# EAGLE design TCS3103 (EAGLE 6.4)
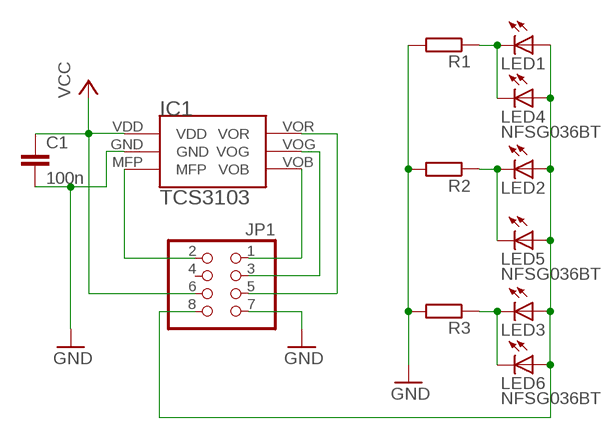
[diagram p0: schematic, sheet 1]

## Parts
C1  100n  C-EUC0805  [C0805]
IC1  TCS3103  [TCS3103]
JP1  PINHD-2X4  [2X04]
LED1  LED3MM  [LED3MM]
LED2  LED3MM  [LED3MM]
LED3  LED3MM  [LED3MM]
LED4  NFSG036BT  [NFSG036BT]
LED5  NFSG036BT  [NFSG036BT]
LED6  NFSG036BT  [NFSG036BT]
R1  R-EU_M0805  [M0805]
R2  R-EU_M0805  [M0805]
R3  R-EU_M0805  [M0805]

## Nets
GND: C1.2 IC1.GND JP1.7 R1.2 R2.2 R3.2
N$1: IC1.VOB JP1.1
N$2: IC1.VOG JP1.3
N$3: IC1.VOR JP1.5
N$4: IC1.MFP JP1.2
N$5: LED1.K(C) LED4.C R1.1
N$6: JP1.8 LED1.A LED2.A LED3.A LED4.A LED5.A LED6.A
N$7: LED3.K(C) LED6.C R3.1
N$8: LED2.K(C) LED5.C R2.1
VCC: C1.1 IC1.VDD JP1.6
Unconnected: JP1.4

## Library data of the parts
C1 = rcl:C-EU: CAPACITOR, European symbol
IC1 = BEEP:TCS3103
JP1 = pinhead:PINHD-2X4: PIN HEADER
LED1-LED3 = led:LED: LED OSRAM: - CHIPLED LG R971, LG N971, LY N971, LG Q971, LY Q971, LO R971, LY R971 LH N974, LH R974 LS Q976, LO Q976, LY Q976 LO Q996 - Hyper CHIPLED LW Q18S LB Q993, LB Q99A, LB R99A - SideLED LS A670, LO A670, LY A670, LG A670, LP A670 LB A673, LV A673, LT A673, LW A673 LH A674 LY A675 LS A676, LA A676, LO A676, LY A676, LW A676 LS A679, LY A679, LG A679 - Hyper Micro SIDELED® LS Y876, LA Y876, LO Y876, LY Y876 LT Y87S - SmartLED LW L88C, LW L88S LB L89C, LB L89S, LG L890 LS L89K, LO L89K, LY L89K LS L896, LA L896, LO L896, LY L896 - TOPLED LS T670, LO T670, LY T670, LG T670, LP T670 LSG T670, LSP T670, LSY T670, LOP T670, LYG T670 LG T671, LOG T671, LSG T671 LB T673, LV T673, LT T673, LW T673 LH T674 LS T676, LA T676, LO T676, LY T676, LB T676, LH T676, LSB T676, LW T676 LB T67C, LV T67C, LT T67C, LS T67K, LO T67K, LY T67K, LW E67C LS E67B, LA E67B, LO E67B, LY E67B, LB E67C, LV E67C, LT E67C LW T67C LS T679, LY T679, LG T679 LS T770, LO T770, LY T770, LG T770, LP T770 LB T773, LV T773, LT T773, LW T773 LH T774 LS E675, LA E675, LY E675, LS T675 LS T776, LA T776, LO T776, LY T776, LB T776 LHGB T686 LT T68C, LB T68C - Hyper Mini TOPLED® LB M676 - Mini TOPLED Santana® LG M470 LS M47K, LO M47K, LY M47K Source: http://www.osram.convergy.de LUXEON: - LUMILED® LXK2-PW12-R00, LXK2-PW12-S00, LXK2-PW14-U00, LXK2-PW14-V00 LXK2-PM12-R00, LXK2-PM12-S00, LXK2-PM14-U00 LXK2-PE12-Q00, LXK2-PE12-R00, LXK2-PE12-S00, LXK2-PE14-T00, LXK2-PE14-U00 LXK2-PB12-K00, LXK2-PB12-L00, LXK2-PB12-M00, LXK2-PB14-N00, LXK2-PB14-P00, LXK2-PB14-Q00 LXK2-PR12-L00, LXK2-PR12-M00, LXK2-PR14-Q00, LXK2-PR14-R00 LXK2-PD12-Q00, LXK2-PD12-R00, LXK2-PD12-S00 LXK2-PH12-R00, LXK2-PH12-S00 LXK2-PL12-P00, LXK2-PL12-Q00, LXK2-PL12-R00 Source: www.luxeon.com KINGBRIGHT: KA-3528ASYC Source: www.kingbright.com
LED4-LED6 = led:NFSG036BT: CHIP TYPE GREEN LED NFSx036xT Source: NICHIA CORPORATION .. NFSG036BT-E.pdf
R1-R3 = rcl:R-EU_: RESISTOR, European symbol

## Board
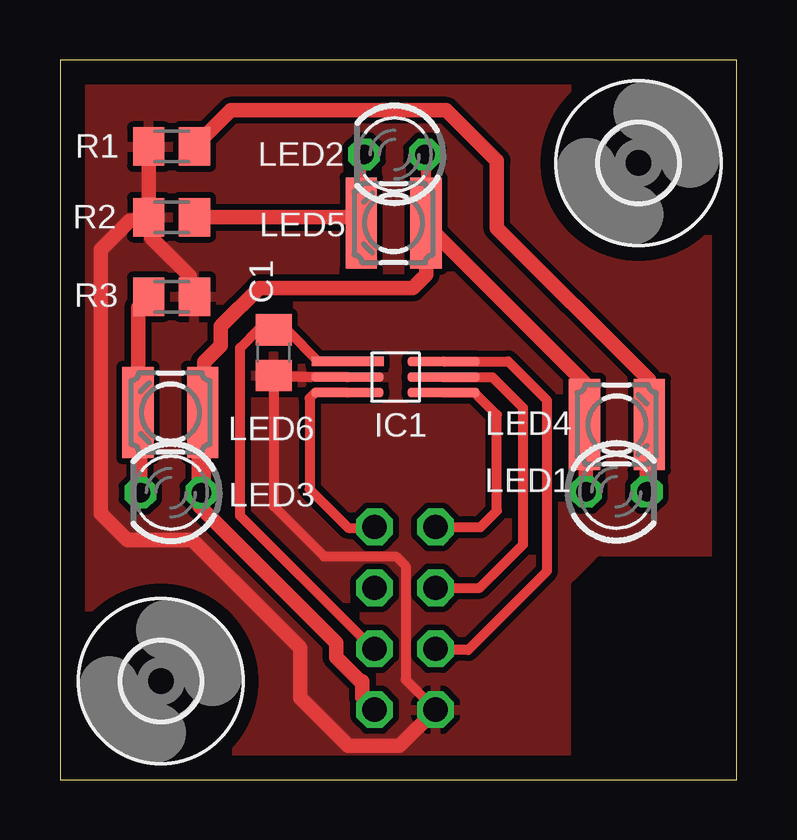
[diagram p1: board, top side]
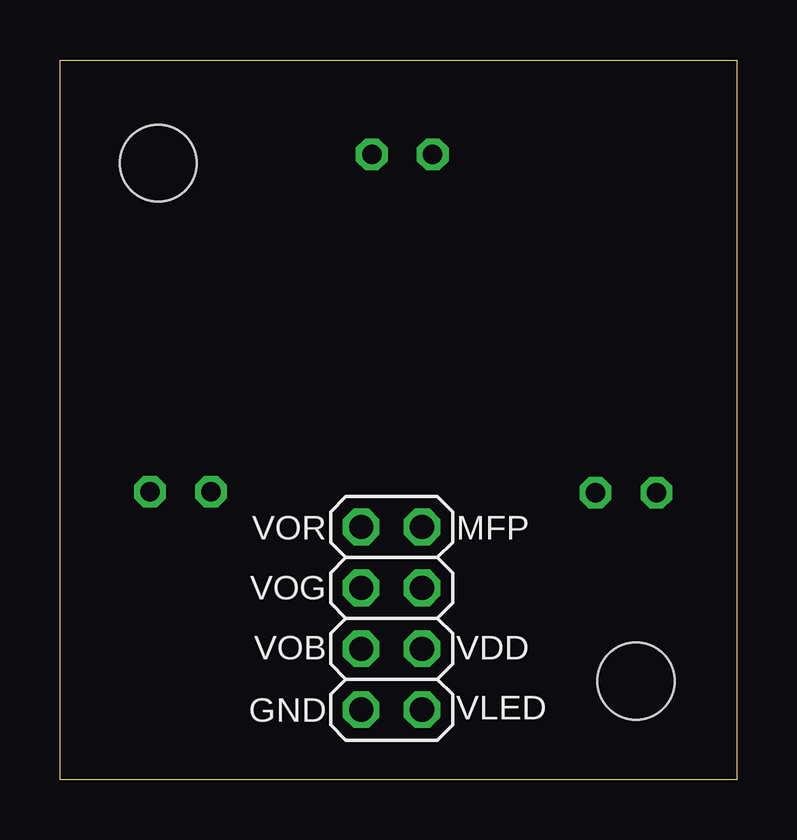
[diagram p2: board, bottom side, seen from below]

Size 28.2 x 30 mm. Coordinates in mm from the lower left corner, seen from the top.
Outline: 0,0 28.2,0 28.2,30 0,30 0,0
Copper layers (1*16): Top 0.035mm / dielectric 1.5mm / Bottom 0.035mm
Design rules "default *": minimum track width 10mil, minimum drill 24mil, track to track 10mil, track to pad 10mil, pad to pad 8mil, via to via 8mil, smd to smd 8mil, copper to edge 40mil, drill to drill 8mil, minimum pad ring 10mil, minimum via ring 8mil, stop-mask expansion 4mil, vias tented up to drill 0mil, thermal gap 10mil
tRestrict: 5 lines

### Footprints (pad centres in the part's own frame; a part is rotated, then mirrored left to right if it is on the bottom)
C0805 = smd 1.3 x 1.5: 1 -0.95,0; 2 0.95,0
TCS3103 = smd 3 x 0.4: GND -2,0; MFP -2,-0.65; VDD -2,0.65; VOB 2,-0.65; VOG 2,0; VOR 2,0.65
2X04 = drill 1.016 octagon: 1 -3.81,-1.27; 2 -3.81,1.27; 3 -1.27,-1.27; 4 -1.27,1.27; 5 1.27,-1.27; 6 1.27,1.27; 7 3.81,-1.27; 8 3.81,1.27
LED3MM = drill 0.813 octagon: A -1.27,0; K 1.27,0
NFSG036BT = smd 1.3 x 3.8: A 1.35,0; C -1.35,0
M0805 = smd 1.3 x 1.6: 1 -0.95,0; 2 0.95,0
3,2 = hole 3.2: 0,0

### Placement (x,y rotation side)
C1  8.9,17.8 270 top
IC1  13.98,16.78 0 top
JP1  14.38,6.72 270 bottom
LED1  23.18,12 0 top
LED2  13.94,26.06 180 top
LED3  4.62,11.96 180 top
LED4  23.2,14.8 180 top
LED5  13.9,23.2 0 top
LED6  4.6,15.3 0 top
R1  4.65,26.39 180 top
R2  4.65,23.44 180 top
R3  4.65,20.13 0 top
U$1  LOGO-COPPER4  [COPPER4]  23.9,1.4 90 top
U$3  [3,2]  4.2,4.1 0 top
U$4  [3,2]  24.1,25.7 0 top

### Tracks (layer width: path | path; a pad name or v marks a point on that pad's centre or on a via)
GND
  Top 0.406: IC1.GND 8.97,16.78 C1.2 8.9,11.4 11,9.3 14,9.3 14.4,8.9 14.4,4.16 JP1.7 | 5.4,20.33 R3.2
  Top 0.61: JP1.7 14.14,1.4 12,1.4 10,3.4 10,5.5 5.5,10 2.8,10 1.7,11.1 1.7,22.1 2.9,23.3 3.56,23.3 R2.2 | R2.2 R1.2 | 5.4,20.33 5.4,21 3.8,22.6 3.8,23.34 R2.2
  pour Top: 0,30 28.2,30 28.2,0 0,0
N$1
  Top 0.406: IC1.VOB 17.27,16.13 18.2,15.2 18.2,11.2 17.53,10.53 JP1.1
N$2
  Top 0.406: IC1.VOG 18.02,16.78 19.3,15.5 19.3,9.8 17.49,7.99 JP1.3
N$3
  Top 0.406: IC1.VOR 18.67,17.43 20.3,15.8 20.3,8.7 17,5.4 15.7,5.4 JP1.5
N$4
  Top 0.406: IC1.MFP 10.63,16.13 10.4,15.9 10.4,12.1 12,10.5 13.04,10.5 JP1.2
N$5
  Top 0.406: 24.45,14.7 LED4.C 24.55,16.65
  Top 0.61: LED1.K 24.45,14.7 | 24.55,16.65 18.2,23 18.2,25.8 16.1,27.9 7.11,27.9 R1.1
N$6
  Top 0.406: 21.91,14.74 LED4.A 21.85,16.55 | LED2.A 15.25,26.02 LED5.A 15.7,22.75 15.7,22.7 | 5.79,15.04 LED6.A 6,17.05 | 5.8,11.95 LED3.A | 12.6,4.1 12.5,4.1
  Top 0.61: LED1.A 21.91,14.74 | 21.85,16.55 15.7,22.7 | LED5.A 15.25,21.05 14.7,20.5 8.3,20.5 6.7,18.9 6.7,18.1 6,17.4 6,17.05 | 5.8,11.95 5.8,11.4 11.5,5.7 11.5,5.1 12.5,4.1 | 12.6,4.1 12.6,3.42 JP1.8
  Top 0.813: LED3.A 5.89,15.24 LED6.A
N$7
  Top 0.61: LED3.K 3.35,15.2 | LED6.C 3.25,19.68 R3.1
  Top 0.813: 3.35,15.2 LED6.C
N$8
  Top 0.406: 12.35,23 LED5.C 12.55,25.94 LED2.K
  Top 0.61: R2.1 12.31,23.44 LED5.C
VCC
  Top 0.406: JP1.6 13.05,5.45 7.5,11 7.5,18 8.3,18.8 8.85,18.8 C1.1 8.95,18.7 9.5,18.7 10.77,17.43 IC1.VDD

### Text on the board
bNames: MFP | VOR | VOG | VDD | VOB | VLED | GND
tCName: TCS3103 / v0.1.1